# EAGLE design simhid-g1000_left (EAGLE 9.6.2)
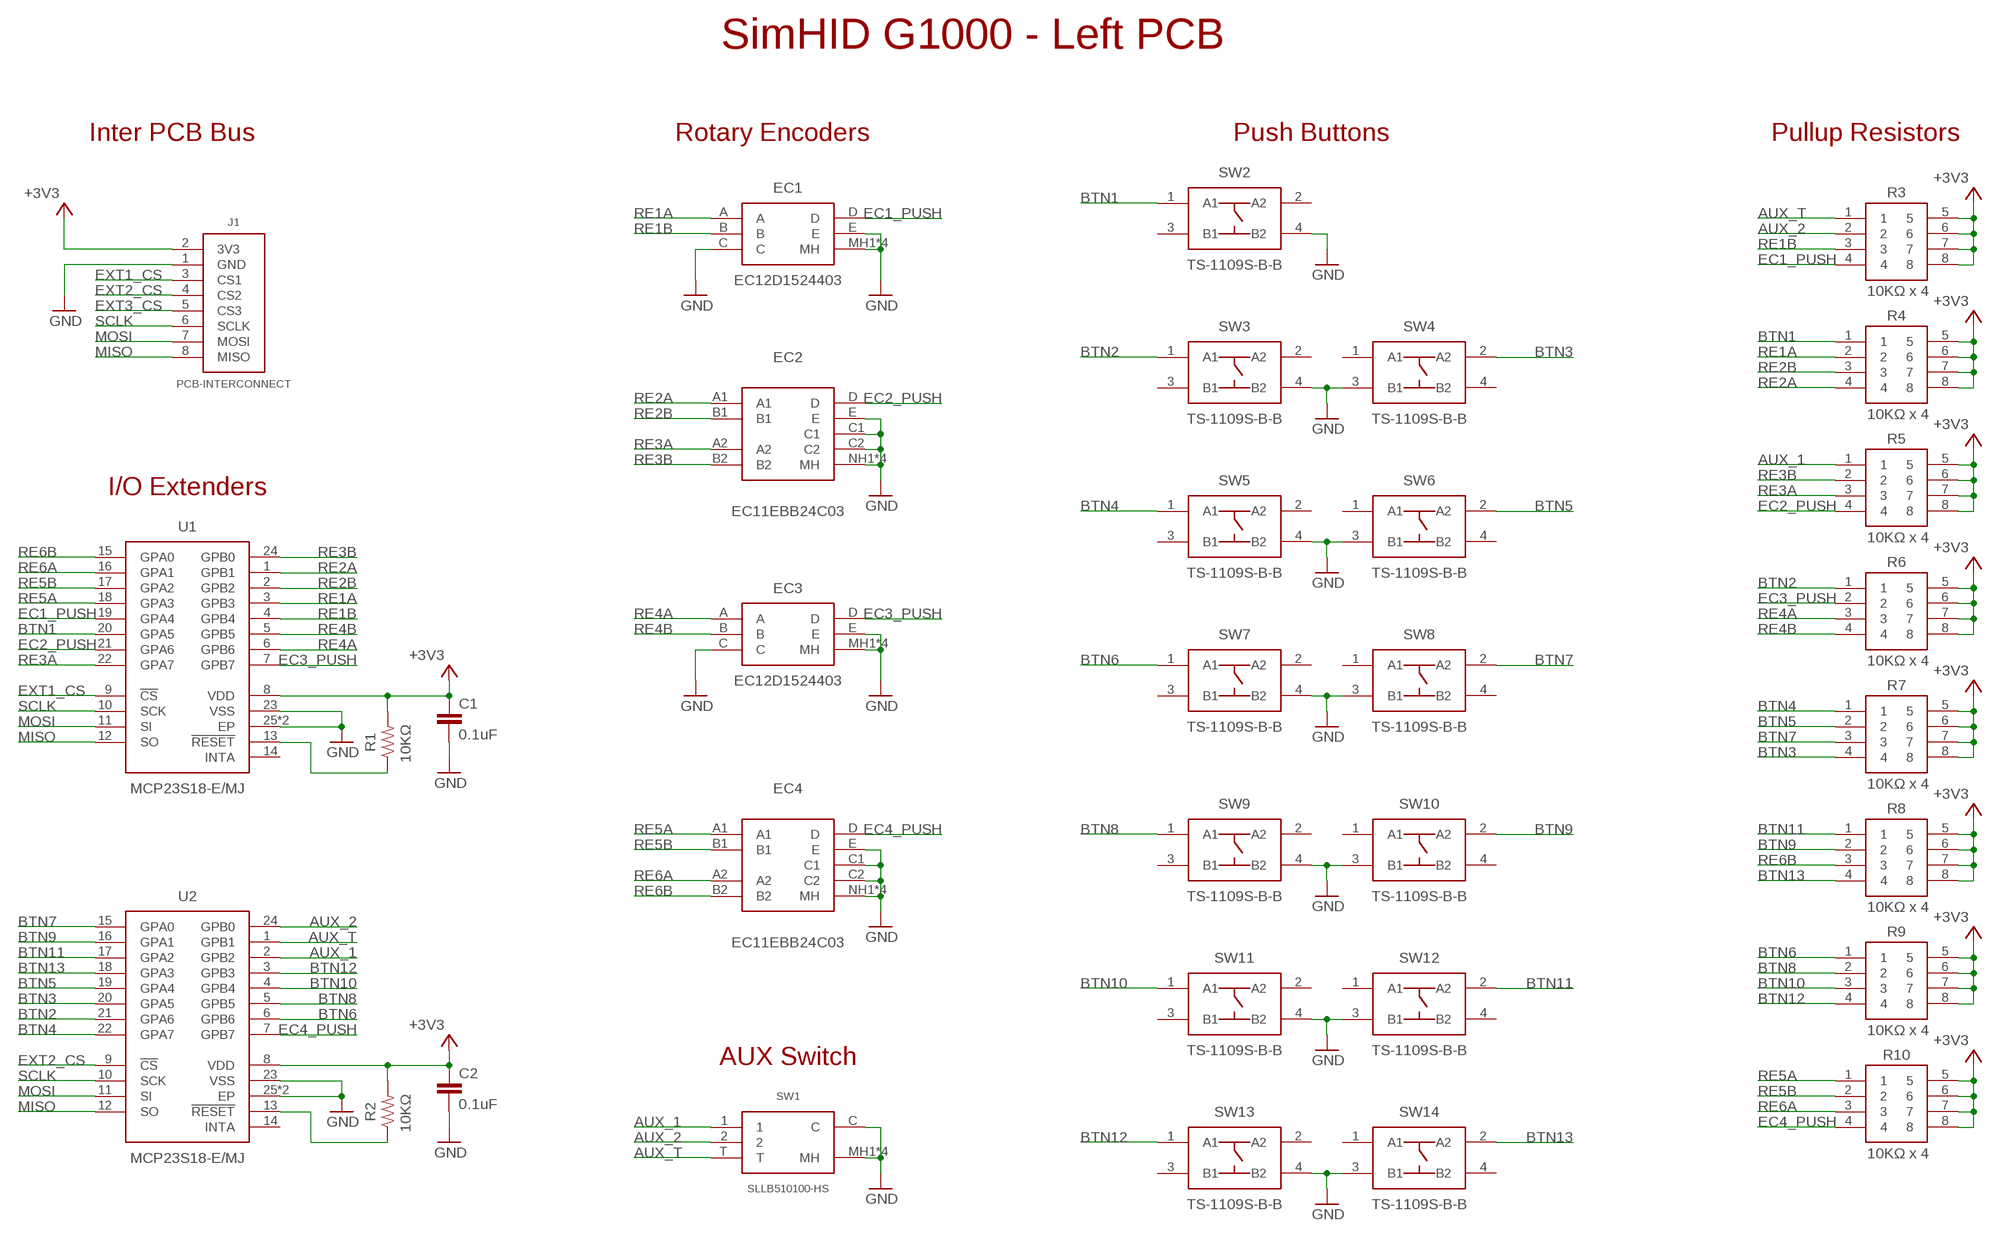
[diagram p0: schematic, sheet 1]

## Parts
C1  0.1uF  RCL_C-EUC0402-HS  [RCL_C0402_HS]
C2  0.1uF  RCL_C-EUC0402-HS  [RCL_C0402_HS]
EC1  EC12D1524403  [EC12D1524403]
EC2  EC11EBB24C03  [EC11EBB24C03]
EC3  EC12D1524403  [EC12D1524403]
EC4  EC11EBB24C03  [EC11EBB24C03]
J1  PCB-INTERCONNECT  [PCB-INTERCONNECT]
R1  10KΩ  RCL_R-US_R0402-HS  [RCL_R0402_HS]
R2  10KΩ  RCL_R-US_R0402-HS  [RCL_R0402_HS]
R3  10KΩ x 4  BCN164A102J7  [BCN164A_1]
R4  10KΩ x 4  BCN164A102J7  [BCN164A_1]
R5  10KΩ x 4  BCN164A102J7  [BCN164A_1]
R6  10KΩ x 4  BCN164A102J7  [BCN164A_1]
R7  10KΩ x 4  BCN164A102J7  [BCN164A_1]
R8  10KΩ x 4  BCN164A102J7  [BCN164A_1]
R9  10KΩ x 4  BCN164A102J7  [BCN164A_1]
R10  10KΩ x 4  BCN164A102J7  [BCN164A_1]
SW1  SLLB510100-HS  [SLLB510100-HS]
SW2  TS-1109S-B-B  [TS-1109S-B-B]
SW3  TS-1109S-B-B  [TS-1109S-B-B]
SW4  TS-1109S-B-B  [TS-1109S-B-B]
SW5  TS-1109S-B-B  [TS-1109S-B-B]
SW6  TS-1109S-B-B  [TS-1109S-B-B]
SW7  TS-1109S-B-B  [TS-1109S-B-B]
SW8  TS-1109S-B-B  [TS-1109S-B-B]
SW9  TS-1109S-B-B  [TS-1109S-B-B]
SW10  TS-1109S-B-B  [TS-1109S-B-B]
SW11  TS-1109S-B-B  [TS-1109S-B-B]
SW12  TS-1109S-B-B  [TS-1109S-B-B]
SW13  TS-1109S-B-B  [TS-1109S-B-B]
SW14  TS-1109S-B-B  [TS-1109S-B-B]
U1  MCP23S18-E/MJ  MCP23S18-E_MJ-HS  [QFN50P400X400X90-25N-HS]
U2  MCP23S18-E/MJ  MCP23S18-E_MJ-HS  [QFN50P400X400X90-25N-HS]

## Nets
+3V3: C1.1 C2.1 J1.2(3V3) R1.2 R2.2 R3.5 R3.6 R3.7 R3.8 R4.5 R4.6 R4.7 R4.8 R5.5 R5.6 R5.7 R5.8 R6.5 R6.6 R6.7 R6.8 R7.5 R7.6 R7.7 R7.8 R8.5 R8.6 R8.7 R8.8 R9.5 R9.6 R9.7 R9.8 R10.5 R10.6 R10.7 R10.8 U1.8(VDD) U2.8(VDD)
AUX_1: R5.1 SW1.1 U2.2(GPB2)
AUX_2: R3.2 SW1.2 U2.24(GPB0)
AUX_T: R3.1 SW1.T U2.1(GPB1)
BTN1: R4.1 SW2.1(A1) U1.20(GPA5)
BTN2: R6.1 SW3.1(A1) U2.21(GPA6)
BTN3: R7.4 SW4.2(A2) U2.20(GPA5)
BTN4: R7.1 SW5.1(A1) U2.22(GPA7)
BTN5: R7.2 SW6.2(A2) U2.19(GPA4)
BTN6: R9.1 SW7.1(A1) U2.6(GPB6)
BTN7: R7.3 SW8.2(A2) U2.15(GPA0)
BTN8: R9.2 SW9.1(A1) U2.5(GPB5)
BTN9: R8.2 SW10.2(A2) U2.16(GPA1)
BTN10: R9.3 SW11.1(A1) U2.4(GPB4)
BTN11: R8.1 SW12.2(A2) U2.17(GPA2)
BTN12: R9.4 SW13.1(A1) U2.3(GPB3)
BTN13: R8.4 SW14.2(A2) U2.18(GPA3)
EC1_PUSH: EC1.D R3.4 U1.19(GPA4)
EC2_PUSH: EC2.D R5.4 U1.21(GPA6)
EC3_PUSH: EC3.D R6.2 U1.7(GPB7)
EC4_PUSH: EC4.D R10.4 U2.7(GPB7)
EXT1_CS: J1.3(CS1) U1.9(!CS)
EXT2_CS: J1.4(CS2) U2.9(!CS)
EXT3_CS: J1.5(CS3)
GND: C1.2 C2.2 EC1.C EC1.E EC1.MH1(MH) EC1.MH2(MH) EC1.MH3(MH) EC1.MH4(MH) EC2.C1 EC2.C2 EC2.E EC2.NH1(MH) EC2.NH2(MH) EC2.NH3(MH) EC2.NH4(MH) EC3.C EC3.E EC3.MH1(MH) EC3.MH2(MH) EC3.MH3(MH) EC3.MH4(MH) EC4.C1 EC4.C2 EC4.E EC4.NH1(MH) EC4.NH2(MH) EC4.NH3(MH) EC4.NH4(MH) J1.1(GND) SW1.C SW1.MH1(MH) SW1.MH2(MH) SW1.MH3(MH) SW1.MH4(MH) SW2.4(B2) SW3.4(B2) SW4.3(B1) SW5.4(B2) SW6.3(B1) SW7.4(B2) SW8.3(B1) SW9.4(B2) SW10.3(B1) SW11.4(B2) SW12.3(B1) SW13.4(B2) SW14.3(B1) U1.23(VSS) U1.25(EP) U1.25-H(EP) U2.23(VSS) U2.25(EP) U2.25-H(EP)
MISO: J1.8(MISO) U1.12(SO) U2.12(SO)
MOSI: J1.7(MOSI) U1.11(SI) U2.11(SI)
N$3: R1.1 U1.13(!RESET)
N$19: R2.1 U2.13(!RESET)
RE1A: EC1.A R4.2 U1.3(GPB3)
RE1B: EC1.B R3.3 U1.4(GPB4)
RE2A: EC2.A1 R4.4 U1.1(GPB1)
RE2B: EC2.B1 R4.3 U1.2(GPB2)
RE3A: EC2.A2 R5.3 U1.22(GPA7)
RE3B: EC2.B2 R5.2 U1.24(GPB0)
RE4A: EC3.A R6.3 U1.6(GPB6)
RE4B: EC3.B R6.4 U1.5(GPB5)
RE5A: EC4.A1 R10.1 U1.18(GPA3)
RE5B: EC4.B1 R10.2 U1.17(GPA2)
RE6A: EC4.A2 R10.3 U1.16(GPA1)
RE6B: EC4.B2 R8.3 U1.15(GPA0)
SCLK: J1.6(SCLK) U1.10(SCK) U2.10(SCK)
Unconnected: SW2.2(A2) SW2.3(B1) SW3.2(A2) SW3.3(B1) SW4.1(A1) SW4.4(B2) SW5.2(A2) SW5.3(B1) SW6.1(A1) SW6.4(B2) SW7.2(A2) SW7.3(B1) SW8.1(A1) SW8.4(B2) SW9.2(A2) SW9.3(B1) SW10.1(A1) SW10.4(B2) SW11.2(A2) SW11.3(B1) SW12.1(A1) SW12.4(B2) SW13.2(A2) SW13.3(B1) SW14.1(A1) SW14.4(B2) U1.14(INTA) U2.14(INTA)

## Notes on the sheet
- SimHID G1000 - Left PCB
- Inter PCB Bus | Rotary Encoders | Push Buttons | Pullup Resistors
- I/O Extenders
- AUX Switch

## Library data of the parts
C1 C2 = gen-discrete3:RCL_C-EU: CAPACITOR, European symbol
EC1 EC3 = RotaryEncoder:EC12D1524403
EC2 EC4 = RotaryEncoder:EC11EBB24C03
J1 = SimHID-G1000:PCB-INTERCONNECT
R1 R2 = gen-discrete3:RCL_R-US_: RESISTOR, American symbol
R3-R10 = BCN164A102J7:BCN164A102J7: BI TECHNOLOGIES / TT ELECTRONICS - BCN164A102J7 - RESISTOR, RESISTOR ARRAY, 4, 1KOHM, 5%, 1206 Source: Datasheet <http://www.farnell.com/datasheets/2158867.pdf>; ARROW_PART_NUMBER: BCN164A102J7; DESCRIPTION: BI TECHNOLOGIES / TT ELECTRONICS - BCN164A102J7 - RESISTOR, RESISTOR ARRAY, 4, 1KOHM, 5%, 1206; HEIGHT: mm; MANUFACTURER_NAME: BI Technologies; MANUFACTURER_PART_NUMBER: BCN164A102J7
SW1 = Switches:SLLB510100
SW2-SW14 = Switches:TS-1109S-B-B
U1 U2 = MCP23S18-E_MJ:MCP23S18-E_MJ: Microchip MCP23S18-E/MJ, 16-channel 16bit I/O Expander 10MHz, Serial-SPI, 24-Pin QFN Source: Datasheet <http://ww1.microchip.com/downloads/en/DeviceDoc/22103a.pdf>

## Board
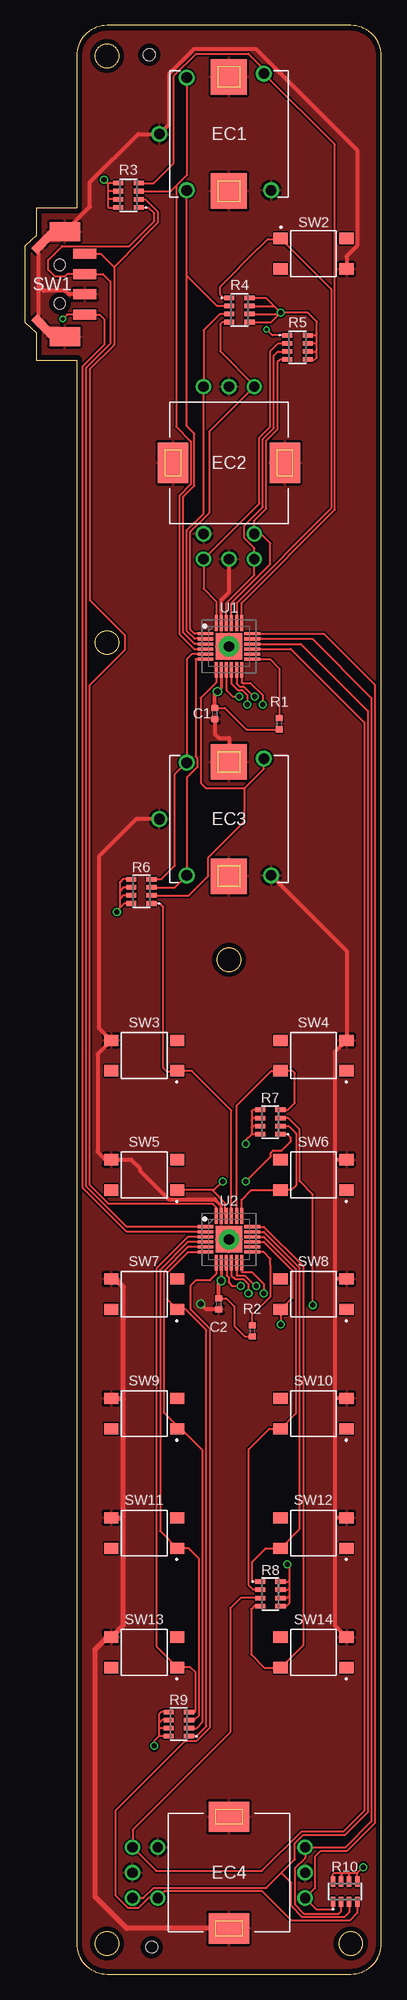
[diagram p1: board, top side]
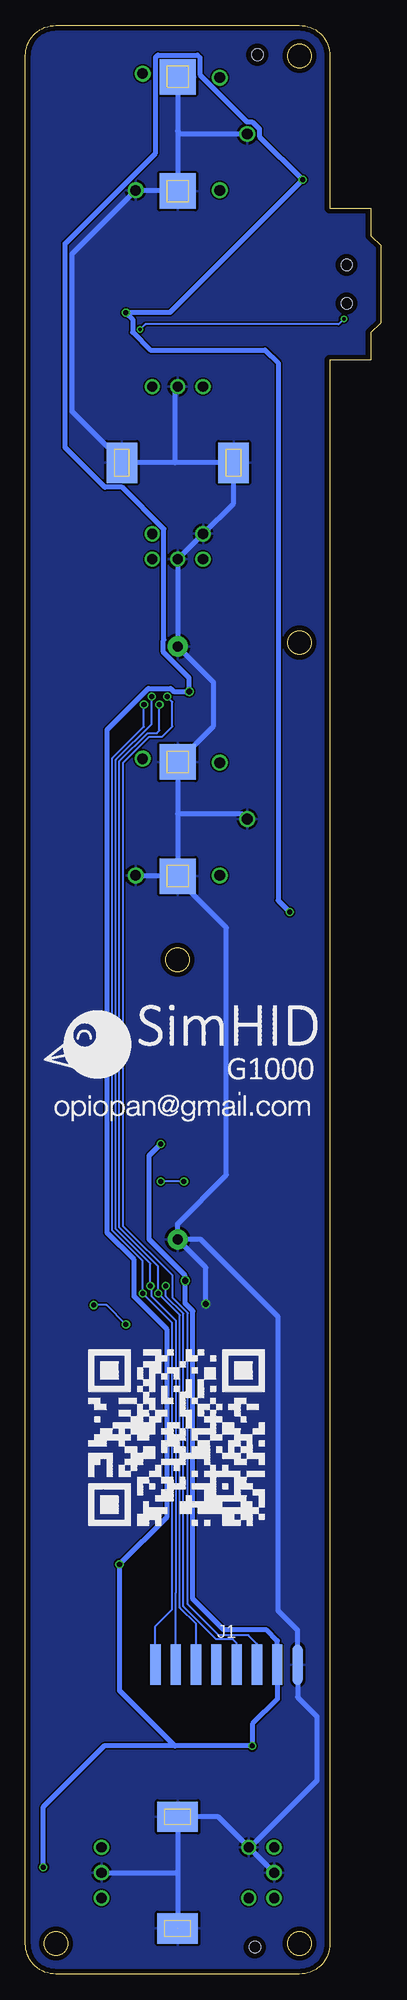
[diagram p2: board, bottom side, seen from below]

Size 35.05 x 192 mm. Coordinates in mm from the lower left corner, seen from the top.
Outline: 1.05,161.7 1.05,159 5.05,159 5.05,3 arc90 8.05,0 32.05,0 arc90 35.05,3 35.05,189 arc90 32.05,192 8.05,192 arc90 5.05,189 5.05,174 1.05,174 1.05,171.3 0,170.3 0,162.7 1.05,161.7
Outline: circle at 8.05,3 radius 1.15
Outline: circle at 8.05,131.19 radius 1.15
Outline: circle at 20.05,99.94 radius 1.15
Outline: circle at 32.05,3 radius 1.15
Outline: circle at 8.05,189 radius 1.15
Copper layers (1*16): Top 0.035mm / dielectric 1mm / Bottom 0.035mm
Design rules "Elecrow_2-layer_PCB_eagle_rule *": minimum track width 6mil, minimum drill 12mil, track to track 6mil, track to pad 6mil, pad to pad 6mil, via to via 8mil, smd to smd 0mil, copper to edge 20mil, drill to drill 10mil, minimum pad ring 6mil, minimum via ring 6mil, stop-mask expansion 0mil, vias tented up to drill 100mil, thermal gap 10mil
Holes 2.3 mm at 8.05,189 8.05,131.19 20.05,99.94 8.05,3 32.05,3
Holes 1.15 mm at 12.19,189.1 12.45,2.67

### Footprints (pad centres in the part's own frame; a part is rotated, then mirrored left to right if it is on the bottom)
RCL_C0402_HS = smd 0.6 x 0.7: 1 -0.55,0; 2 0.55,0
EC12D1524403 = drill 1.05: A 5.55,-4.15; B -5.55,-4.15; C 5.55,4.15; D -5.95,3.45; E 0,-6.85 | smd 3.5 x 3.55: MH1 -5.625,0; MH3 5.625,0 | smd 3.5 x 3.55 bottom: MH2 -5.625,0; MH4 5.625,0
EC11EBB24C03 = drill 1: A1 2.5,7.5; A2 2.5,-9.5; B1 -2.5,7.5; B2 -2.5,-9.5; C1 0,7.5; C2 0,-9.5; D 2.5,-7; E -2.5,-7 | smd 3 x 4: NH1 5.5,0; NH3 -5.5,0 | smd 3 x 4 bottom: NH2 5.5,0; NH4 -5.5,0
PCB-INTERCONNECT = smd 1 x 4: 1 -7,0; 2 -5,0; 3 -3,0; 4 -1,0; 5 1,0; 6 3,0; 7 5,0; 8 7,0
RCL_R0402_HS = smd 0.6 x 0.7: 1 -0.55,0; 2 0.55,0
BCN164A_1 = smd 0.45 x 1: 1 -1.2,-1; 2 -0.4,-1; 3 0.4,-1; 4 1.2,-1; 5 -1.2,1; 6 -0.4,1; 7 0.4,1; 8 1.2,1
SLLB510100-HS = smd 1 x 2.3: 1 -3,-1.45; 2 3,-1.45; C -1,-1.45; T 1,-1.45 | smd 2.6 x 0.8 rotated 45: MH1 -4.172,2.616 | smd 2.6 x 0.8 rotated 315: MH2 4.172,2.616 | smd 1.85 x 3: MH3 -5.175,0.5; MH4 5.175,0.5 | hole 1.1: 1.9,1; -1.9,1
TS-1109S-B-B = smd 1.4 x 1.1: 1 -3.25,1.5; 2 3.25,1.5; 3 -3.25,-1.5; 4 3.25,-1.5
QFN50P400X400X90-25N-HS = smd 1.55 x 0.3: 1 -2.3,1.25; 2 -2.3,0.75; 3 -2.3,0.25; 4 -2.3,-0.25; 5 -2.3,-0.75; 6 -2.3,-1.25; 13 2.3,-1.25; 14 2.3,-0.75; 15 2.3,-0.25; 16 2.3,0.25; 17 2.3,0.75; 18 2.3,1.25 | smd 0.3 x 1.55: 7 -1.25,-2.3; 8 -0.75,-2.3; 9 -0.25,-2.3; 10 0.25,-2.3; 11 0.75,-2.3; 12 1.25,-2.3; 19 1.25,2.3; 20 0.75,2.3; 21 0.25,2.3; 22 -0.25,2.3; 23 -0.75,2.3; 24 -1.25,2.3 | smd 2.6 x 2.6: 25 0,0 | drill 1 pad 2: 25-H 0,0

### Placement (x,y rotation side)
C1  18.67,124.21 270 top
C2  19.05,66.04 270 top
EC1  20.05,181.3 270 top
EC2  20.05,148.9 0 top
EC3  20.05,113.8 270 top
EC4  20.05,10 270 top
J1  15.24,30.48 180 bottom
R1  25.02,123.19 270 top
R2  22.35,63.37 270 top
R3  10.16,175.26 90 top
R4  21.08,163.96 270 top
R5  26.8,160.27 270 top
R6  11.43,106.68 90 top
R7  24.13,83.95 90 top
R8  24.13,37.47 270 top
R9  15.11,24.64 90 top
R10  31.5,8.13 0 top
SW1  4.4,166.5 90 top
SW2  28.38,169.5 0 top
SW3  11.72,90.5 180 top
SW4  28.38,90.5 180 top
SW5  11.72,78.74 180 top
SW6  28.38,78.74 180 top
SW7  11.72,66.98 180 top
SW8  28.38,66.98 180 top
SW9  11.72,55.22 180 top
SW10  28.38,55.22 180 top
SW11  11.72,43.46 180 top
SW12  28.38,43.46 180 top
SW13  11.72,31.7 180 top
SW14  28.38,31.7 180 top
U1  20.05,130.81 0 top
U2  20.05,72.39 0 top
U$1  [SIMHID-G1000-LOGO]  33.4,82.68 0 bottom
U$2  [SHIMHID-G1000-QRCODE]  31.24,41.78 0 bottom

### Tracks (layer width: path | path; a pad name or v marks a point on that pad's centre or on a via)
+3V3  (via drill 0.5, 0.6)
  Top 0.2: R3.8 8.07,176.46 | 8.07,176.46 v7.75,176.78 | 8.07,176.46 8.13,176.4 8.13,175.64 | 8.13,175.64 8.13,174.88 | 8.13,174.88 8.13,174.12 8.19,174.06 R3.5 | R3.6 8.15,174.86 8.13,174.88 | R3.7 8.15,175.66 8.13,175.64 | R4.5 23.69,165.16 24.49,164.36 | 24.49,164.36 v25.15,163.7 | R4.6 24.49,164.36 | R4.7 25,163.56 v25.15,163.7 | R4.8 24.2,162.76 v25.15,163.7 | R5.5 28.5,161.47 28.7,161.67 | 28.7,161.67 28.7,162.81 27.81,163.7 v25.15,163.7 | R5.6 28.59,160.67 28.7,160.78 | 28.7,160.78 28.7,161.67 | R5.7 28.56,159.87 28.7,160.02 | 28.7,160.02 28.7,160.78 | R5.8 28.52,159.07 28.7,159.26 28.7,160.02 | R6.5 9.72,105.48 9.27,105.03 | v9.02,104.65 9.02,104.78 9.27,105.03 | R6.6 9.67,106.28 9.65,106.3 9.27,105.92 | 9.27,105.92 9.27,105.03 | R6.7 10.41,107.06 9.65,107.06 9.27,106.68 | 9.27,106.68 9.27,105.92 | R6.8 9.58,107.88 9.27,107.57 9.27,106.68 | R10.8 32.7,9.96 | 32.7,9.96 v33.27,10.54 | R10.7 31.9,9.8 32.06,9.96 | 32.06,9.96 32.7,9.96 | R10.6 31.1,9.76 31.3,9.96 | 31.3,9.96 32.06,9.96 | R10.5 30.3,9.85 30.41,9.96 31.3,9.96 | R7.5 22.3,82.75 | v21.72,81.79 21.72,82.17 22.3,82.75 | R7.6 22.46,83.55 22.3,83.38 | 22.3,83.38 22.3,82.75 | R7.7 22.5,84.35 22.3,84.14 | 22.3,84.14 22.3,83.38 | R7.8 22.41,85.15 22.3,85.03 22.3,84.14 | R8.5 25.84,38.66 26.04,38.86 | v25.78,40.39 26.04,40.13 26.04,38.86 | R8.6 25.8,37.87 26.04,38.1 | 26.04,38.1 26.04,38.86 | R8.7 25.76,37.06 26.04,37.34 | 26.04,37.34 26.04,38.1 | R8.8 25.72,36.27 26.04,36.58 26.04,37.34 | R9.5 13.15,23.44 | v12.7,22.48 12.7,22.99 13.15,23.44 | R9.6 13.35,24.24 13.34,24.26 13.15,24.07 | 13.15,24.07 13.15,23.44 | R9.7 13.48,25.04 13.15,24.71 | 13.15,24.71 13.15,24.07 | R9.8 13.39,25.84 13.15,25.6 13.15,24.71
  Top 0.2: C2.1 19.77,66.59 20.57,65.79 20.57,63.88 21.63,62.82 R2.2 | C1.1 19.64,124.76 21.76,122.64 R1.2
  Top 0.3: U1.8 19.3,126.74 v18.92,126.36 | U2.8 v19.3,68.33
  Top 0.4: C1.1 18.67,126.11 v18.92,126.36 | C2.1 19.05,68.07 v19.3,68.33
  Bottom 0.5: v33.27,10.54 33.27,16.51 27.3,22.48 20.32,22.48 | 20.32,22.48 v12.7,22.48 12.7,24.64 10.24,27.1 J1.2 10.24,32.85 11.3,33.9 15.49,33.9 18.55,36.96 18.55,65.34 19.3,66.1 v19.3,68.33 19.3,68.83 22.86,72.39 22.86,80.64 v21.72,81.79 | 20.32,22.48 25.78,27.94 v25.78,40.39 21.09,45.07 21.09,63.52 24.34,66.76 24.34,70.4 26.99,73.04 26.99,122.61 22.94,126.66 20.75,126.66 20.45,126.36 v18.92,126.36 18.92,127.7 21.45,130.23 21.45,131.39 21.4,131.45 21.4,142.38 25.52,146.5 27.22,146.5 31.13,150.41 31.13,170.5 22.23,179.41 22.23,188.84 21.99,189.08 18.11,189.08 17.87,188.84 17.87,187.14 13.22,182.49 12.71,182.49 12.01,181.79 12.01,181.05 v7.75,176.78 20.83,163.7 v25.15,163.7 24.48,163.04 24.48,161.75 22.75,160.02 11.43,160.02 10.16,158.75 10.16,105.79 v9.02,104.65
AUX_1  (via drill 0.35)
  Top 0.2: U2.2 9.96,73.14 5.66,77.44 5.66,158.44 7.75,160.53 7.75,163.07 7.32,163.5 SW1.1 4.12,163.5 v3.68,163.07 | R5.1 24.33,161.47 v23.75,162.05
  Bottom 0.2: v3.68,163.07 4.19,162.56 23.24,162.56 v23.75,162.05
AUX_2
  Top 0.2: SW1.2 7.41,169.5 8.73,168.18 | 8.73,168.18 8.73,160.51 6.36,158.14 6.36,135.37 9.81,131.92 9.81,130.47 6.36,127.02 6.36,77.74 8.21,75.89 18.47,75.89 18.8,75.56 U2.24 | 8.73,168.18 11.43,170.87 11.43,170.95 13.05,172.57 13.05,173.63 11.82,174.86 R3.2
AUX_T
  Top 0.2: U2.1 9.96,73.64 6.01,77.59 6.01,158.28 8.38,160.66 8.38,166.75 7.63,167.5 SW1.T 4.14,167.5 3.88,167.24 2.92,167.24 2.24,167.92 2.24,168.88 3.62,170.25 10.23,170.25 12.7,172.72 12.7,173.48 12.12,174.06 R3.1
BTN1
  Top 0.2: SW2.1 25.19,170.94 | 25.19,170.94 30.13,166 30.13,144.43 20.8,135.1 U1.20 | 25.19,170.94 23.88,170.94 22.99,170.05 22.96,170.02 19.18,166.24 19.18,165.48 19.5,165.16 R4.1
BTN2
  Top 0.2: U2.21 20.3,85.11 16.41,89 SW3.1 14.87,88.9 13.97,88.9 13.59,89.28 13.59,105.16 13.27,105.48 R6.1
BTN3
  Top 0.2: U2.20 20.8,85.57 24.23,89 SW4.2 26.32,89 26.54,88.77 26.54,85.85 25.84,85.15 R7.4
BTN4  (via drill 0.5)
  Top 0.2: U2.22 19.71,74.78 19.71,75.93 18.4,77.24 | 18.4,77.24 SW5.1 | v19.43,78.11 18.57,77.24 18.4,77.24 | v21.72,78.11 24.18,80.57 24.18,80.89 24.44,81.15 25.27,81.15 26.16,82.04 26.16,82.42 25.84,82.75 R7.1
  Bottom 0.2: v19.43,78.11 v21.72,78.11
BTN5
  Top 0.2: U2.19 21.3,76.29 22.25,77.24 SW6.2 26.19,77.24 26.67,77.72 26.67,82.8 25.93,83.55 R7.2
BTN6
  Top 0.2: R9.1 16.17,23.5 16.89,23.5 17.82,24.43 17.82,63.46 15.8,65.48 SW7.1 13.97,66.48 13.97,69.09 16,71.12 17.73,71.12 U2.6
BTN7  (via drill 0.5)
  Top 0.2: v28.32,65.91 28.32,76.83 27.02,78.13 27.02,83.21 25.89,84.35 R7.3 | SW8.2 25.15,65.47 | 25.15,65.47 v25.15,64.01 | U2.15 23.49,72.14 26.29,69.34 26.29,66.61 25.15,65.47
  Bottom 0.2: v25.15,64.01 27.05,65.91 v28.32,65.91
BTN8
  Top 0.152: SW9.1
  Top 0.2: R9.2 16.87,24.24 17.47,24.84 17.47,51.62 15.37,53.72 15.24,53.72 | 15.24,53.72 SW9.1 | U2.5 16.01,71.64 13.62,69.24 13.62,55.34 15.24,53.72
BTN9
  Top 0.2: R8.2 22.46,37.87 22,38.33 22,51.72 24,53.72 SW10.2 26.64,55.23 26.64,69.49 23.49,72.64 U2.16
BTN10
  Top 0.2: R9.3 16.66,25.04 17.12,25.5 17.12,40.92 16.08,41.96 SW11.1 13.27,43.66 13.27,69.39 16.02,72.14 U2.4
BTN11
  Top 0.2: R8.1 22.42,38.66 22.35,38.73 22.35,40.64 23.67,41.96 SW12.2 26.99,43.82 26.99,69.63 23.49,73.14 U2.17
BTN12
  Top 0.152: 14.97,30.23 SW13.1
  Top 0.2: R9.4 16.69,25.84 16.76,25.91 16.76,29.72 16.26,30.23 14.97,30.23 12.91,32.28 12.91,69.54 16.02,72.64 U2.3
BTN13
  Top 0.2: R8.4 22.55,36.27 22.23,35.94 22.23,31.5 23.52,30.2 SW14.2 27.35,32.41 27.35,69.78 23.49,73.64 U2.18
EC1_PUSH
  Top 0.2: U1.19 21.3,135.09 30.48,144.27 30.48,180.27 EC1.D 23.5,187.7 21.97,189.23 16.81,189.23 14.61,187.03 14.61,178.44 12.63,176.46 R3.4
EC2_PUSH
  Top 0.2: U1.21 20.3,135.1 24.13,138.93 24.13,140.97 23.2,141.9 EC2.D 22.55,143.2 23.75,144.4 23.75,151.1 24.82,152.18 24.82,158.81 25.09,159.07 R5.4
EC3_PUSH
  Top 0.2: U1.7 18.8,127.26 17.27,125.73 17.27,119.95 17.29,119.93 17.29,117.33 17.78,116.84 21.59,116.84 | EC3.D 23.5,118.75 21.59,116.84 | R6.2 16.11,106.28 18.02,108.19 18.02,110.03 21.59,113.6 21.59,116.84
EC4_PUSH
  Top 0.2: R10.4 32.7,6.03 31.93,5.26 26.23,5.26 23.35,8.15 13.7,8.15 EC4.D 12.13,7.5 11.13,6.5 10.13,6.5 8.89,7.74 8.89,12.7 8.89,12.83 8.89,16.13 15.72,22.96 16.86,22.96 18.17,24.28 18.17,63.6 16.26,65.52 16.26,67.82 16.76,68.33 18.16,68.33 18.8,68.97 U2.7
EXT1_CS  (via drill 0.5)
  Top 0.2: U1.9 19.8,126.5 20.45,125.86 v21.08,125.86
  Bottom 0.2: J1.3 12.24,32.56 13.08,33.4 16,33.4 19.05,36.45 19.05,65.13 20.55,66.64 20.55,68.81 25.4,73.66 25.4,119.38 22.86,121.92 21.59,121.92 20.57,122.94 20.57,125.35 v21.08,125.86
EXT2_CS  (via drill 0.5)
  Top 0.2: U2.9 19.81,70.08 19.81,68.81 20.01,68.62 20.01,68.13 20.32,67.82 v21.21,67.82
  Bottom 0.2: J1.4 14.24,32.61 14.62,32.99 16.23,32.99 19.49,36.24 19.49,65.07 21.21,66.79 v21.21,67.82
GND  (via drill 0.6)  (1 unrouted)
  Top 0.2: SW1.MH4 3.74,171.52 3.56,171.7 2.82,171.7 SW1.MH2
  Top 0.3: U1.23 19.3,135.38 | U2.23 19.3,75.69 18.8,76.2
  Top 0.4: EC2.C2 20.05,136.13 19.3,135.38 | 18.8,76.2 18.66,76.34 14.12,76.34 11.3,79.16 11.3,79.38 10.44,80.24 SW5.4 7.9,80.24 7.11,81.03 7.11,90.64 SW3.4 7.24,93.23 7.24,110.11 10.93,113.8 EC3.E | SW1.MH4 6.35,174.12 6.35,176.53 11.12,181.3 EC1.E 14.15,182.25 14.15,187.21 16.62,189.68 22.68,189.68 32.69,179.68 32.69,170.3 31.63,169.25 SW2.4 | SW1.C 4.28,165.5 3.92,165.86 1.78,165.86 1.27,166.37 | 1.27,170.18 1.27,166.37 | 1.27,166.37 1.27,162.56 2.5,161.32 SW1.MH3 2.79,161.32 SW1.MH1 | C1.2 18.67,122.17 19.05,121.79 20.07,121.79 20.07,119.44 EC3.MH2 | EC3.C 31.63,100.82 SW4.3 30.48,90.85 30.48,80.14 | SW14.3 30.48,34.35 30.48,45.09 | 30.48,80.14 30.48,68.45 | 30.48,68.45 30.48,56.64 | 30.48,56.64 30.48,45.09 | SW12.3 30.61,44.96 30.48,45.09 | SW10.3 30.56,56.72 30.48,56.64 | SW8.3 30.51,68.48 30.48,68.45 | SW6.3 30.58,80.24 30.48,80.14 | C2.2 17.82,65.49 v17.27,66.04
  Top 0.5: EC4.NH2 9.98,4.5 6.86,7.62 6.86,32 8.05,33.2 SW13.4 9.65,34.38 9.65,45.09 | 9.65,45.09 9.65,56.64 | 9.65,56.64 9.65,67.69 8.86,68.48 SW7.4 | SW9.4 9.57,56.72 9.65,56.64 | SW11.4 9.53,44.96 9.65,45.09
  Bottom 0.5: EC1.MH2 20.05,181.61 | 20.05,181.61 EC1.MH4 20.12,175.75 EC1.C 30.48,169.47 30.48,153.98 25.4,148.9 | 20.05,181.61 19.74,181.3 EC1.E | 20.32,148.9 EC2.NH4 14.55,144.9 EC2.E EC2.C2 U1.25-H 16.51,127.27 16.51,122.97 EC3.MH2 20.05,114.3 | 20.32,148.9 25.4,148.9 | 25.4,148.9 EC2.NH2 | EC2.C1 20.32,156.13 20.32,148.9 | 20.05,114.3 EC3.MH4 20.32,108.18 | EC3.E 13.7,114.3 20.05,114.3 | 20.32,108.18 24.12,108.18 EC3.C | 20.05,10.16 EC4.NH4 16.05,15.5 EC4.E | 20.05,10.16 EC4.NH2 | EC4.C1 20.21,10 20.05,10.16 | EC4.C2 EC4.E | EC4.E 12.9,12.5 6.35,19.05 6.35,25.4 8.24,27.29 J1.1 8.24,33.89 10.16,35.81 10.16,64.77 17.78,72.39 U2.25-H | U2.25-H 20.05,73.93 15.24,78.74 15.24,103.1 20.32,108.18 | v17.27,66.04 17.27,69.61 U2.25-H
  pour Top: -1.27,193.04 36.83,193.04 36.83,8.89 36.83,-1.27 10.16,-1.27 -1.27,-1.27
  pour Bottom: -2.54,195.58 39.37,195.58 39.37,194.31 39.37,12.7 39.37,-3.81 12.7,-3.81 -2.54,-3.81
MISO  (via drill 0.5)
  Top 0.2: U1.12 21.3,127.29 21.37,127.22 22.17,127.22 23.37,126.02 v23.37,125.09 | U2.12 21.3,69.21 21.34,69.18 22.3,69.18 23.5,67.98 v23.5,67.06
  Bottom 0.2: v23.37,125.09 23.37,122.91 26.49,119.79 26.49,73.25 23.5,70.26 v23.5,67.06 20.59,64.15 20.59,35.92 22.24,34.27 J1.8
MOSI  (via drill 0.5)
  Top 0.2: U1.11 20.8,127.16 21.09,126.86 21.5,126.86 22.51,125.86 v22.61,125.86 | U2.11 20.8,68.85 20.83,68.83 21.63,68.83 22.63,67.82 v22.73,67.82
  Bottom 0.2: J1.7 20.24,37.55 20.19,37.59 20.19,64.35 22.63,66.78 22.63,67.71 v22.73,67.82 22.73,70 26.13,73.4 26.13,119.64 22.61,123.17 v22.61,125.86
N$3
  Top 0.2: U1.13 24.11,129.56 25.02,128.65 R1.1
N$19
  Top 0.2: R2.1 22.35,64.99 24.15,66.78 24.15,69.83 24.13,69.85 24.13,70.48 23.48,71.14 U2.13
RE1A
  Top 0.2: U1.3 16.66,131.06 15.55,132.17 15.55,145.55 16.66,146.65 16.66,151.77 15.9,152.53 15.9,167.36 | EC1.A 15.9,167.64 15.9,167.36 | R4.2 18.9,164.36 15.9,167.36
RE1B
  Top 0.2: EC1.B 15.9,177.22 14.86,176.18 | U1.4 16.63,130.56 15.2,131.99 15.2,145.69 16.3,146.8 16.3,151.01 14.86,152.45 14.86,176.18 | R3.3 14.34,175.66 14.86,176.18
RE2A
  Top 0.2: U1.1 16.66,132.06 16.26,132.46 16.26,142.11 18.11,143.96 18.11,151.96 EC2.A1 22.61,156.46 19.18,159.89 19.18,162.56 19.37,162.76 R4.4
RE2B
  Top 0.2: U1.2 16.66,131.56 15.9,132.31 15.9,142.26 17.55,143.91 17.55,156.21 EC2.B1 17.55,161.95 19.16,163.56 R4.3
RE3A
  Top 0.2: U1.22 19.8,135.1 22.55,137.85 EC2.A2 22.55,140.48 21.55,141.49 21.55,142.7 23.4,144.54 23.4,151.25 24.47,152.32 24.47,159.47 24.87,159.87 R5.3
RE3B
  Top 0.2: U1.24 18.8,135.25 17.55,136.5 EC2.B2 23.04,144.9 23.04,151.39 24.12,152.47 24.12,159.88 24.91,160.67 R5.2
RE4A
  Top 0.2: U1.6 17.73,129.54 16.76,129.54 16.76,119.96 16.94,119.78 16.94,118.92 15.9,117.88 EC3.A 14.73,107.08 R6.3
RE4B
  Top 0.2: U1.5 16.39,130.06 15.9,129.56 15.9,119.38 | 15.9,119.38 EC3.B | R6.4 13.39,107.88 14.73,109.22 14.73,118.21 15.9,119.38
RE5A
  Top 0.2: U1.18 29.41,132.06 34.44,127.03 34.44,14.89 31.7,12.15 29.08,12.15 28.55,11.62 28.55,8.5 EC4.A1 28.7,6.35 30.23,6.35 30.3,6.42 R10.1
RE5B
  Top 0.2: U1.17 28.26,131.56 34.09,125.73 34.09,15.04 31.55,12.5 EC4.B1 27.55,11.42 26.55,10.41 26.55,8.01 26.54,8 26.54,6.86 27.43,5.97 30.86,5.97 31.1,6.2 R10.2
RE6A
  Top 0.2: EC4.A2 11.63,7.5 12.63,8.5 23.74,8.5 25.21,9.97 | 25.21,9.97 26.55,11.31 26.55,12.91 27.35,13.72 31.5,13.72 33.74,15.96 33.74,124.46 27.14,131.06 U1.16 | R10.3 31.9,6.12 31.4,5.62 27.29,5.62 26.19,6.71 26.19,8.99 25.21,9.97
RE6B
  Top 0.2: EC4.B2 10.57,12.48 | 10.57,12.48 12.89,10.16 23.29,10.16 27.2,14.07 31.35,14.07 33.38,16.1 33.38,123.32 26.14,130.56 U1.15 | R8.3 21.19,37.06 20.16,36.04 20.16,23.8 10.57,14.21 10.57,12.48
SCLK  (via drill 0.5)
  Top 0.2: U1.10 20.3,127.15 20.93,126.51 21.35,126.51 21.84,126.02 v21.84,125.09 | U2.10 20.3,68.85 20.68,68.47 21.48,68.47 21.97,67.98 v21.97,67.06
  Bottom 0.2: J1.6 18.24,34.5 19.84,36.1 19.84,64.93 v21.97,67.06 21.97,69.73 25.78,73.54 25.78,119.5 23.01,122.27 22.1,122.27 21.84,122.53 v21.84,125.09